# Altium schematic sheet Э3-1.SchDoc
size 594 x 420 mm; Author: Гавриленко; CompanyName: OPEN SOURCE; Address1: Address1; Address2: Address2; Address3: Address3; Address4: Address4; SheetNumber: 1; SheetTotal: 12; DocumentType: Схема электрическая принципиальная
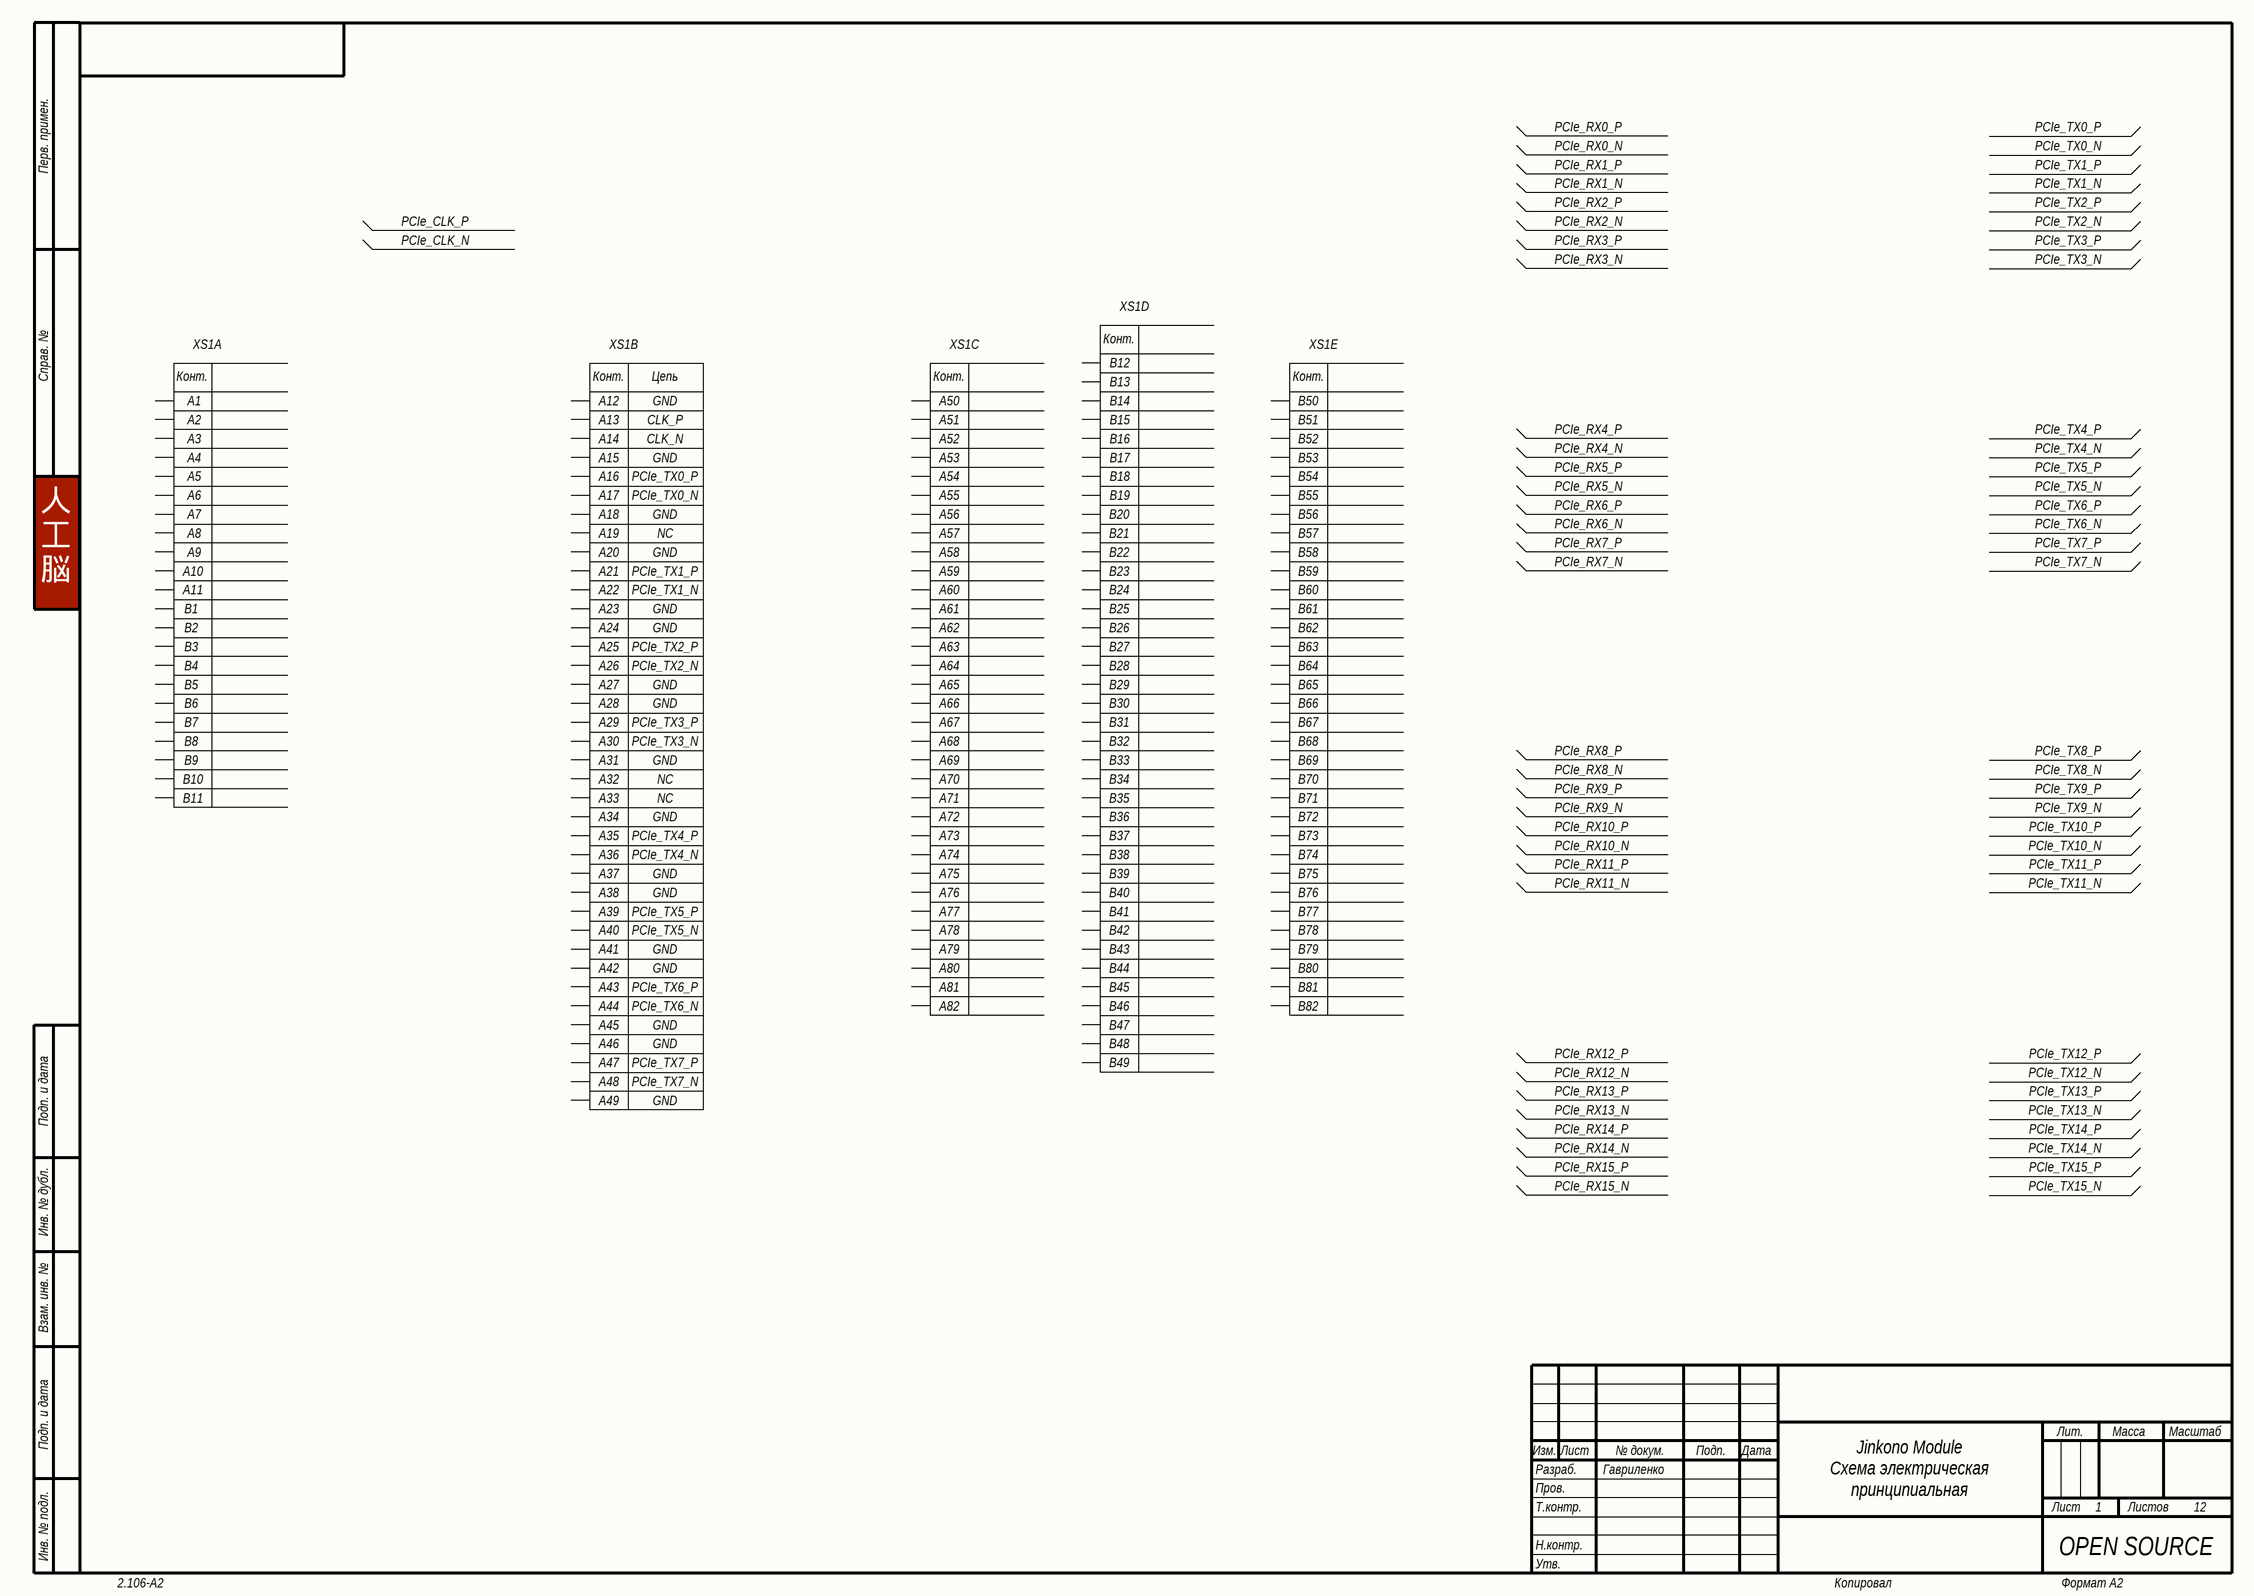
[diagram p0: Э3-1.SchDoc]

## Parts
XS1  1  [PCIe x16 Board Edge Connector]  (value not drawn)  (parts A,B,C,D,E of 5)

## Nets

Not connected (* = marked no-connect by the designer): XS1 A1 A2 A3 A4 A5 A6 A7 A8 A9 A10 A11 A12 A13 A14 A15 A16 A17 A18 A19 A20 A21 A22 A23 A24 A25 A26 A27 A28 A29 A30 A31 A32 A33 A34 A35 A36 A37 A38 A39 A40 A41 A42 A43 A44 A45 A46 A47 A48 A49 A50 A51 A52 A53 A54 A55 A56 A57 A58 A59 A60 A61 A62 A63 A64 A65 A66 A67 A68 A69 A70 A71 A72 A73 A74 A75 A76 A77 A78 A79 A80 A81 A82 B1 B2 B3 B4 B5 B6 B7 B8 B9 B10 B11 B12 B13 B14 B15 B16 B17 B18 B19 B20 B21 B22 B23 B24 B25 B26 B27 B28 B29 B30 B31 B32 B33 B34 B35 B36 B37 B38 B39 B40 B41 B42 B43 B44 B45 B46 B47 B48 B49 B50 B51 B52 B53 B54 B55 B56 B57 B58 B59 B60 B61 B62 B63 B64 B65 B66 B67 B68 B69 B70 B71 B72 B73 B74 B75 B76 B77 B78 B79 B80 B81 B82

## Notes on the sheet
- GND
- Цепь
- CLK_P
- CLK_N
- PCIe_TX0_P
- PCIe_TX0_N
- NC
- PCIe_TX1_P
- PCIe_TX1_N
- 人
  工
  脳
- PCIe_TX2_P
- PCIe_TX2_N
- PCIe_TX3_P
- PCIe_TX3_N
- PCIe_TX4_P
- PCIe_TX4_N
- PCIe_TX5_P
- PCIe_TX5_N
- PCIe_TX6_P
- PCIe_TX6_N
- PCIe_TX7_P
- PCIe_TX7_N
- Jinkono Module
  Схема электрическая
  принципиальная
- Перв. примен.
- Справ. №
- Подп. и дата
- Инв. № дубл.
- Взам. инв. №
- Разраб.
- Изм.
- Лист
- № докум.
- Подп.
- Дата
- Лит.
- Масса
- Масштаб
- Пров.
- Т.контр.
- Листов
- Инв. № подл.
- Утв.
- Н.контр.
- 2.106-A2
- Копировал
- Формат А2
- (in symbol XP_PCe_x16, part A) Конт.
- (in symbol XP_PCe_x16, part B) Конт.
- (in symbol XP_PCe_x16, part C) Конт.
- (in symbol XP_PCe_x16, part D) Конт.
- (in symbol XP_PCe_x16, part E) Конт.

## Library data of the parts
XS1 = XP_PCe_x16: TemperatureRange: -...+°C; ComponentType: Вилка; Install: 1